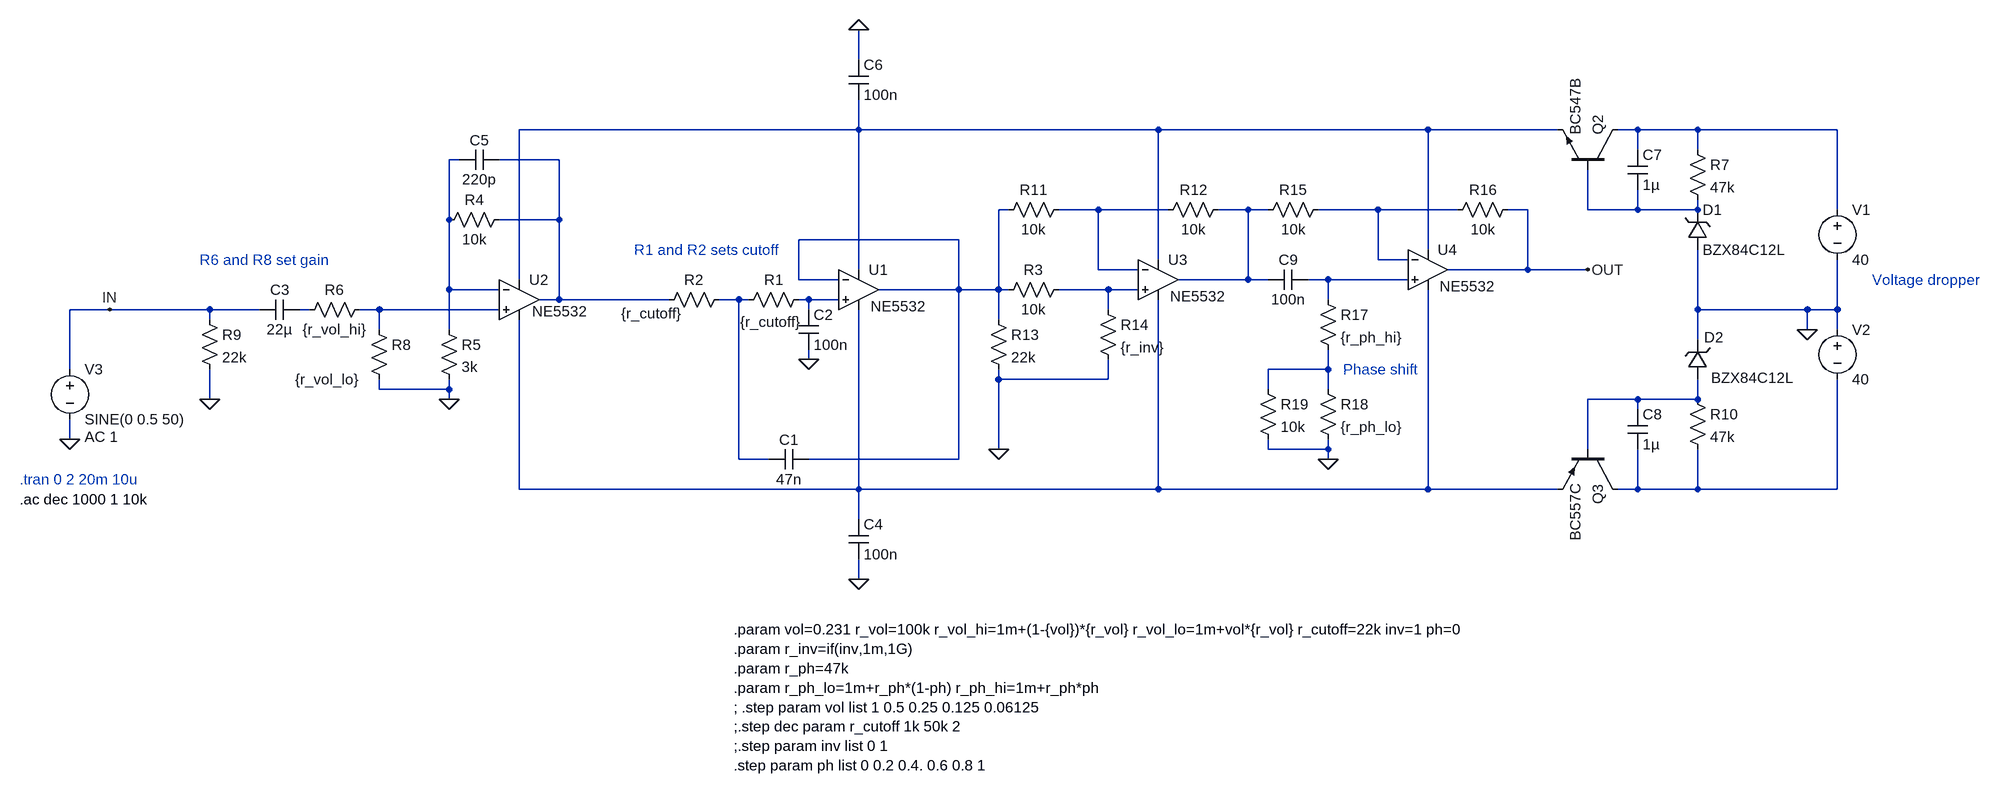
[diagram p0: schematic preamp.asc]
preamp.asc, the LTspice schematic file:
Version 4
SHEET 1 2212 916
WIRE 400 -208 400 -256
WIRE 400 -96 400 -144
WIRE 400 -96 -144 -96
WIRE 880 -96 400 -96
WIRE 1312 -96 880 -96
WIRE 1520 -96 1312 -96
WIRE 1648 -96 1616 -96
WIRE 1744 -96 1648 -96
WIRE 1968 -96 1744 -96
WIRE 1648 -64 1648 -96
WIRE 1744 -64 1744 -96
WIRE -240 -48 -256 -48
WIRE -80 -48 -176 -48
WIRE 640 32 624 32
WIRE 784 32 720 32
WIRE 896 32 784 32
WIRE 1024 32 976 32
WIRE 1056 32 1024 32
WIRE 1232 32 1136 32
WIRE 1360 32 1232 32
WIRE 1472 32 1440 32
WIRE 1568 32 1568 -32
WIRE 1648 32 1648 0
WIRE 1648 32 1568 32
WIRE 1744 32 1744 16
WIRE 1744 32 1648 32
WIRE 1968 32 1968 -96
WIRE -256 48 -256 -48
WIRE -80 48 -80 -48
WIRE -80 48 -176 48
WIRE 560 80 304 80
WIRE 1312 96 1312 -96
WIRE 880 112 880 -96
WIRE 1232 112 1232 32
WIRE 1280 112 1232 112
WIRE 400 128 400 -96
WIRE 784 128 784 32
WIRE 848 128 784 128
WIRE 1472 128 1472 32
WIRE 1472 128 1344 128
WIRE 1568 128 1472 128
WIRE -144 144 -144 -96
WIRE 304 144 304 80
WIRE 368 144 304 144
WIRE 1024 144 1024 32
WIRE 1024 144 912 144
WIRE 1056 144 1024 144
WIRE 1152 144 1120 144
WIRE 1280 144 1152 144
WIRE -256 160 -256 48
WIRE -176 160 -256 160
WIRE 560 160 560 80
WIRE 560 160 432 160
WIRE 624 160 624 32
WIRE 624 160 560 160
WIRE 640 160 624 160
WIRE 800 160 720 160
WIRE 848 160 800 160
WIRE -80 176 -80 48
WIRE -80 176 -112 176
WIRE 96 176 -80 176
WIRE 208 176 176 176
WIRE 224 176 208 176
WIRE 320 176 304 176
WIRE 368 176 320 176
WIRE 1152 176 1152 144
WIRE -800 192 -864 192
WIRE -640 192 -800 192
WIRE -560 192 -640 192
WIRE -480 192 -496 192
WIRE -368 192 -400 192
WIRE -176 192 -368 192
WIRE 320 192 320 176
WIRE 800 192 800 160
WIRE 1744 192 1744 96
WIRE 1920 192 1744 192
WIRE 1968 192 1968 112
WIRE 1968 192 1920 192
WIRE -640 208 -640 192
WIRE 624 208 624 160
WIRE -368 224 -368 192
WIRE -256 224 -256 160
WIRE 1920 224 1920 192
WIRE 1968 224 1968 192
WIRE 1744 240 1744 192
WIRE 320 272 320 256
WIRE -864 288 -864 192
WIRE 1152 288 1152 256
WIRE 1152 288 1056 288
WIRE 624 304 624 288
WIRE 800 304 800 272
WIRE 800 304 624 304
WIRE -368 320 -368 304
WIRE -256 320 -256 304
WIRE -256 320 -368 320
WIRE 1056 320 1056 288
WIRE 1152 320 1152 288
WIRE -640 336 -640 288
WIRE -256 336 -256 320
WIRE 1648 336 1568 336
WIRE 1744 336 1744 304
WIRE 1744 336 1648 336
WIRE 1648 352 1648 336
WIRE -864 400 -864 368
WIRE 624 416 624 304
WIRE 1056 416 1056 400
WIRE 1152 416 1152 400
WIRE 1152 416 1056 416
WIRE 1568 416 1568 336
WIRE 208 432 208 176
WIRE 256 432 208 432
WIRE 560 432 560 160
WIRE 560 432 320 432
WIRE 1152 432 1152 416
WIRE -144 480 -144 208
WIRE 400 480 400 192
WIRE 400 480 -144 480
WIRE 880 480 880 176
WIRE 880 480 400 480
WIRE 1312 480 1312 160
WIRE 1312 480 880 480
WIRE 1520 480 1312 480
WIRE 1648 480 1648 416
WIRE 1648 480 1616 480
WIRE 1744 480 1744 416
WIRE 1744 480 1648 480
WIRE 1968 480 1968 304
WIRE 1968 480 1744 480
WIRE 400 528 400 480
WIRE 400 624 400 592
FLAG 320 272 0
FLAG 1920 224 0
FLAG -800 192 IN
FLAG -864 400 0
FLAG -256 336 0
FLAG -640 336 0
FLAG 400 624 0
FLAG 400 -256 0
FLAG 624 416 0
FLAG 1568 128 OUT
FLAG 1152 432 0
SYMBOL OpAmps\\NE5532 400 160 R0
WINDOW 3 19 27 Left 2
SYMATTR InstName U1
SYMBOL cap 320 416 R90
WINDOW 0 0 32 VBottom 2
WINDOW 3 32 32 VTop 2
SYMATTR InstName C1
SYMATTR Value 47n
SYMBOL res 320 160 R90
WINDOW 0 0 56 VBottom 2
WINDOW 3 36 61 VTop 2
SYMATTR InstName R1
SYMATTR Value {r_cutoff}
SYMBOL res 192 160 R90
WINDOW 0 0 56 VBottom 2
WINDOW 3 22 124 VTop 2
SYMATTR InstName R2
SYMATTR Value {r_cutoff}
SYMBOL cap 304 192 R0
SYMATTR InstName C2
SYMATTR Value 100n
SYMBOL voltage 1968 16 R0
WINDOW 123 0 0 Left 0
WINDOW 39 0 0 Left 0
SYMATTR InstName V1
SYMATTR Value 40
SYMBOL voltage 1968 208 R0
WINDOW 123 0 0 Left 0
WINDOW 39 0 0 Left 0
SYMATTR InstName V2
SYMATTR Value 40
SYMBOL voltage -864 272 R0
WINDOW 123 24 124 Left 2
WINDOW 39 0 0 Left 0
SYMATTR Value2 AC 1
SYMATTR InstName V3
SYMATTR Value SINE(0 0.5 50)
SYMBOL OpAmps\\NE5532 -144 176 R0
WINDOW 3 21 19 Left 2
SYMATTR InstName U2
SYMBOL res -160 32 R90
WINDOW 0 0 56 VBottom 2
WINDOW 3 32 56 VTop 2
SYMATTR InstName R4
SYMATTR Value 10k
SYMBOL res -272 208 R0
SYMATTR InstName R5
SYMATTR Value 3k
SYMBOL res -384 176 R90
WINDOW 0 0 56 VBottom 2
WINDOW 3 32 56 VTop 2
SYMATTR InstName R6
SYMATTR Value {r_vol_hi}
SYMBOL res -384 208 R0
WINDOW 3 -119 96 Left 2
SYMATTR Value {r_vol_lo}
SYMATTR InstName R8
SYMBOL cap -496 176 R90
WINDOW 0 0 32 VBottom 2
WINDOW 3 32 32 VTop 2
SYMATTR InstName C3
SYMATTR Value 22µ
SYMBOL res -656 192 R0
SYMATTR InstName R9
SYMATTR Value 22k
SYMBOL cap -176 -64 R90
WINDOW 0 0 32 VBottom 2
WINDOW 3 32 32 VTop 2
SYMATTR InstName C5
SYMATTR Value 220p
SYMBOL zener 1728 96 M180
WINDOW 0 24 64 Left 2
WINDOW 3 24 0 Left 2
SYMATTR InstName D1
SYMATTR Value BZX84C12L
SYMATTR Description Diode
SYMATTR Type diode
SYMBOL zener 1760 304 R180
WINDOW 0 -25 68 Left 2
WINDOW 3 -137 3 Left 2
SYMATTR InstName D2
SYMATTR Value BZX84C12L
SYMATTR Description Diode
SYMATTR Type diode
SYMBOL res 1728 -80 R0
SYMATTR InstName R7
SYMATTR Value 47k
SYMBOL res 1728 320 R0
SYMATTR InstName R10
SYMATTR Value 47k
SYMBOL npn 1616 -32 M270
SYMATTR InstName Q2
SYMATTR Value BC547B
SYMBOL pnp 1616 416 R90
SYMATTR InstName Q3
SYMATTR Value BC557C
SYMBOL cap 384 528 R0
SYMATTR InstName C4
SYMATTR Value 100n
SYMBOL cap 384 -208 R0
SYMATTR InstName C6
SYMATTR Value 100n
SYMBOL cap 1632 -64 R0
SYMATTR InstName C7
SYMATTR Value 1µ
SYMBOL cap 1632 352 R0
SYMATTR InstName C8
SYMATTR Value 1µ
SYMBOL OpAmps\\NE5532 880 144 R0
WINDOW 3 19 27 Left 2
SYMATTR InstName U3
SYMBOL res 736 144 R90
WINDOW 0 0 56 VBottom 2
WINDOW 3 32 56 VTop 2
SYMATTR InstName R3
SYMATTR Value 10k
SYMBOL res 736 16 R90
WINDOW 0 0 56 VBottom 2
WINDOW 3 32 56 VTop 2
SYMATTR InstName R11
SYMATTR Value 10k
SYMBOL res 992 16 R90
WINDOW 0 0 56 VBottom 2
WINDOW 3 32 56 VTop 2
SYMATTR InstName R12
SYMATTR Value 10k
SYMBOL res 608 192 R0
SYMATTR InstName R13
SYMATTR Value 22k
SYMBOL res 784 176 R0
SYMATTR InstName R14
SYMATTR Value {r_inv}
SYMBOL OpAmps\\NE5532 1312 128 R0
WINDOW 3 19 27 Left 2
SYMATTR InstName U4
SYMBOL cap 1120 128 R90
WINDOW 0 0 32 VBottom 2
WINDOW 3 32 32 VTop 2
SYMATTR InstName C9
SYMATTR Value 100n
SYMBOL res 1152 16 R90
WINDOW 0 0 56 VBottom 2
WINDOW 3 32 56 VTop 2
SYMATTR InstName R15
SYMATTR Value 10k
SYMBOL res 1456 16 R90
WINDOW 0 0 56 VBottom 2
WINDOW 3 32 56 VTop 2
SYMATTR InstName R16
SYMATTR Value 10k
SYMBOL res 1136 160 R0
SYMATTR InstName R17
SYMATTR Value {r_ph_hi}
SYMBOL res 1136 304 R0
SYMATTR InstName R18
SYMATTR Value {r_ph_lo}
SYMBOL res 1040 304 R0
SYMATTR InstName R19
SYMATTR Value 10k
TEXT -944 464 Left 2 ;.tran 0 2 20m 10u
TEXT -944 496 Left 2 !.ac dec 1000 1 10k
TEXT -656 112 Left 2 ;R6 and R8 set gain
TEXT 40 96 Left 2 ;R1 and R2 sets cutoff
TEXT 200 704 Left 2 !.param vol=0.231 r_vol=100k r_vol_hi=1m+(1-{vol})*{r_vol} r_vol_lo=1m+vol*{r_vol} r_cutoff=22k inv=1 ph=0\n.param r_inv=if(inv,1m,1G)\n.param r_ph=47k\n.param r_ph_lo=1m+r_ph*(1-ph) r_ph_hi=1m+r_ph*ph\n; .step param vol list 1 0.5 0.25 0.125 0.06125\n;.step dec param r_cutoff 1k 50k 2\n;.step param inv list 0 1\n.step param ph list 0 0.2 0.4. 0.6 0.8 1
TEXT 1176 288 Left 2 ;Phase shift
TEXT 2024 144 Left 2 ;Voltage dropper

The netlist it stands for:
* preamp.asc
* U1: NE5532 (symbol OpAmps\NE5532 not available, pins judged from their places): In+=N013 In-=N005 V+=N001 V-=N018 OUT=N005
C1 N005 N012 47n
R1 N013 N012 {r_cutoff}
R2 N012 N004 {r_cutoff}
C2 N013 0 100n
V1 N002 0 40
V2 0 N019 40
V3 IN 0 SINE(0 0.5 50) AC 1
* U2: NE5532 (symbol OpAmps\NE5532 not available, pins judged from their places): In+=N015 In-=N003 V+=N001 V-=N018 OUT=N004
R4 N004 N003 10k
R5 N003 0 3k
R6 N015 N014 {r_vol_hi}
R8 N015 0 {r_vol_lo}
C3 N014 IN 22µ
R9 IN 0 22k
C5 N004 N003 220p
D1 0 N009 BZX84C12L
D2 N017 0 BZX84C12L
R7 N002 N009 47k
R10 N017 N019 47k
Q2 N002 N009 N001 0 BC547B
Q3 N019 N017 N018 0 BC557C
C4 N018 0 100n
C6 0 N001 100n
C7 N002 N009 1µ
C8 N017 N019 1µ
* U3: NE5532 (symbol OpAmps\NE5532 not available, pins judged from their places): In+=N011 In-=N006 V+=N001 V-=N018 OUT=N007
R3 N011 N005 10k
R11 N006 N005 10k
R12 N007 N006 10k
R13 N005 0 22k
R14 N011 0 {r_inv}
* U4: NE5532 (symbol OpAmps\NE5532 not available, pins judged from their places): In+=N010 In-=N008 V+=N001 V-=N018 OUT=OUT
C9 N010 N007 100n
R15 N008 N007 10k
R16 OUT N008 10k
R17 N010 N016 {r_ph_hi}
R18 N016 0 {r_ph_lo}
R19 N016 0 10k
.model D D
.lib standard.dio
.model NPN NPN
.model PNP PNP
.lib standard.bjt
* .tran 0 2 20m 10u
.ac dec 1000 1 10k
* R6 and R8 set gain
* R1 and R2 sets cutoff
.param vol=0.231 r_vol=100k r_vol_hi=1m+(1-{vol})*{r_vol} r_vol_lo=1m+vol*{r_vol} r_cutoff=22k inv=1 ph=0
.param r_inv=if(inv,1m,1G)
.param r_ph=47k
.param r_ph_lo=1m+r_ph*(1-ph) r_ph_hi=1m+r_ph*ph
; .step param vol list 1 0.5 0.25 0.125 0.06125
;.step dec param r_cutoff 1k 50k 2
;.step param inv list 0 1
.step param ph list 0 0.2 0.4. 0.6 0.8 1
* Phase shift
* Voltage dropper
.backanno
.end